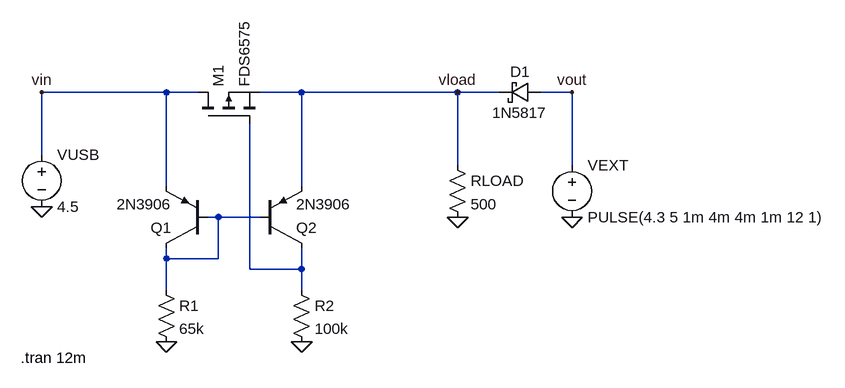
[diagram p0: schematic IdealDiode.asc]
IdealDiode.asc, the LTspice schematic file:
Version 4
SHEET 1 1132 680
WIRE 96 -128 -96 -128
WIRE 144 -128 96 -128
WIRE 304 -128 240 -128
WIRE 544 -128 304 -128
WIRE 608 -128 544 -128
WIRE 720 -128 672 -128
WIRE -96 -32 -96 -128
WIRE 544 -16 544 -128
WIRE 720 -16 720 -128
WIRE 96 16 96 -128
WIRE 304 16 304 -128
WIRE 176 64 160 64
WIRE 240 64 176 64
WIRE 96 128 96 112
WIRE 176 128 176 64
WIRE 176 128 96 128
WIRE 224 144 224 -80
WIRE 304 144 304 112
WIRE 304 144 224 144
WIRE 96 176 96 128
WIRE 304 176 304 144
FLAG 96 256 0
FLAG 304 256 0
FLAG -96 48 0
FLAG 544 64 0
FLAG 720 64 0
FLAG -96 -128 vin
FLAG 720 -128 vout
FLAG 544 -128 vload
SYMBOL pnp 160 112 R180
SYMATTR InstName Q1
SYMATTR Value 2N3906
SYMBOL pnp 240 112 M180
SYMATTR InstName Q2
SYMATTR Value 2N3906
SYMBOL pmos 144 -80 R270
SYMATTR InstName M1
SYMATTR Value FDS6575
SYMBOL res 80 160 R0
SYMATTR InstName R1
SYMATTR Value 65k
SYMBOL res 288 160 R0
SYMATTR InstName R2
SYMATTR Value 100k
SYMBOL voltage -96 -48 R0
WINDOW 123 0 0 Left 0
WINDOW 39 0 0 Left 0
SYMATTR InstName VUSB
SYMATTR Value 4.5
SYMBOL res 528 -32 R0
SYMATTR InstName RLOAD
SYMATTR Value 500
SYMBOL voltage 720 -32 R0
WINDOW 123 0 0 Left 0
WINDOW 39 0 0 Left 0
SYMATTR InstName VEXT
SYMATTR Value PULSE(4.3 5 1m 4m 4m 1m 12 1)
SYMBOL schottky 672 -144 R90
WINDOW 0 0 32 VBottom 2
WINDOW 3 32 32 VTop 2
SYMATTR InstName D1
SYMATTR Value 1N5817
SYMATTR Description Diode
SYMATTR Type diode
TEXT -128 280 Left 2 !.tran 12m

The netlist it stands for:
* IdealDiode.asc
Q1 N001 N001 vin 0 2N3906
Q2 N002 N001 vload 0 2N3906
M1 vin N002 vload vload FDS6575
R1 N001 0 65k
R2 N002 0 100k
VUSB vin 0 4.5
RLOAD vload 0 500
VEXT vout 0 PULSE(4.3 5 1m 4m 4m 1m 12 1)
D1 vout vload 1N5817
.model D D
.lib standard.dio
.model NPN NPN
.model PNP PNP
.lib standard.bjt
.model NMOS NMOS
.model PMOS PMOS
.lib standard.mos
.tran 12m
.backanno
.end